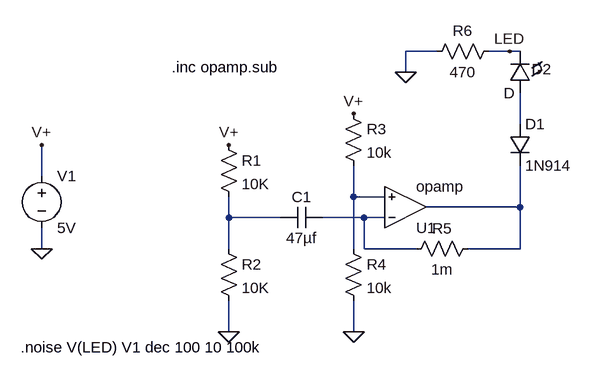
[diagram p0: schematic NoiseDetector.asc]
NoiseDetector.asc, the LTspice schematic file:
Version 4
SHEET 1 880 1068
WIRE 560 -96 512 -96
WIRE 672 -96 640 -96
WIRE 688 -96 672 -96
WIRE 512 -64 512 -96
WIRE 688 16 688 -32
WIRE -48 96 -48 48
WIRE 432 128 432 80
WIRE 480 128 432 128
WIRE 688 144 688 80
WIRE 688 144 544 144
WIRE 240 160 240 128
WIRE 320 160 240 160
WIRE 448 160 384 160
WIRE 480 160 448 160
WIRE -48 208 -48 176
WIRE 240 208 240 160
WIRE 432 208 432 128
WIRE 448 208 448 160
WIRE 528 208 448 208
WIRE 688 208 688 144
WIRE 688 208 608 208
WIRE 240 336 240 288
WIRE 432 336 432 288
FLAG -48 208 0
FLAG -48 48 V+
FLAG 512 -64 0
FLAG 432 336 0
FLAG 240 336 0
FLAG 240 48 V+
FLAG 432 0 V+
FLAG 672 -96 LED
SYMBOL voltage -48 80 R0
WINDOW 123 0 0 Left 0
WINDOW 39 0 0 Left 0
SYMATTR InstName V1
SYMATTR Value 5V
SYMBOL res 224 32 R0
SYMATTR InstName R1
SYMATTR Value 10K
SYMBOL res 224 192 R0
SYMATTR InstName R2
SYMATTR Value 10K
SYMBOL cap 384 144 R90
WINDOW 0 0 32 VBottom 2
WINDOW 3 32 32 VTop 2
SYMATTR InstName C1
SYMATTR Value 47µf
SYMBOL OpAmps\\opamp 512 208 M180
SYMATTR InstName U1
SYMBOL res 416 -16 R0
SYMATTR InstName R3
SYMATTR Value 10k
SYMBOL res 416 192 R0
SYMATTR InstName R4
SYMATTR Value 10k
SYMBOL res 624 192 R90
WINDOW 0 0 56 VBottom 2
WINDOW 3 32 56 VTop 2
SYMATTR InstName R5
SYMATTR Value 1m
SYMBOL res 656 -112 R90
WINDOW 0 0 56 VBottom 2
WINDOW 3 32 56 VTop 2
SYMATTR InstName R6
SYMATTR Value 470
SYMBOL diode 672 16 R0
SYMATTR InstName D1
SYMATTR Value 1N914
SYMBOL LED 704 -32 R180
WINDOW 0 -33 37 Left 2
WINDOW 3 24 0 Left 2
SYMATTR InstName D2
TEXT -80 360 Left 2 !.noise V(LED) V1 dec 100 10 100k
TEXT 152 -72 Left 2 !.inc opamp.sub

The netlist it stands for:
* NoiseDetector.asc
V1 V+ 0 5V
R1 V+ N004 10K
R2 N004 0 10K
C1 N005 N004 47µf
XU1 N005 N002 N003 opamp Aol=100K GBW=10Meg  ; pins invin noninvin out
R3 V+ N002 10k
R4 N002 0 10k
R5 N003 N005 1m
R6 LED 0 470
D1 N001 N003 1N914
D2 N001 LED D
.model D D
.lib standard.dio
.noise V(LED) V1 dec 100 10 100k
.inc opamp.sub
.backanno
.end